# Altium schematic sheet 2 MCU.SchDoc: MCU
size A3; PageSetup: Record=PageOptions|CenterHorizontal=True|CenterVertical=True|PrintScale=1.01|XCorrection=1.00|YCorrection=1.00|PrintKind=2|BorderSize=5000000|LeftOffset=0|BottomOffset=0|Orientation=2|PaperLength=1000|PaperWidth=1000|Scale=100|PaperSource=15|PrintQuality=600|MediaType=1|DitherType=10|PaperKind=A3|PrintScaleMode=1; DocumentNumber: 4; SheetNumber: 3; SheetTotal: 7
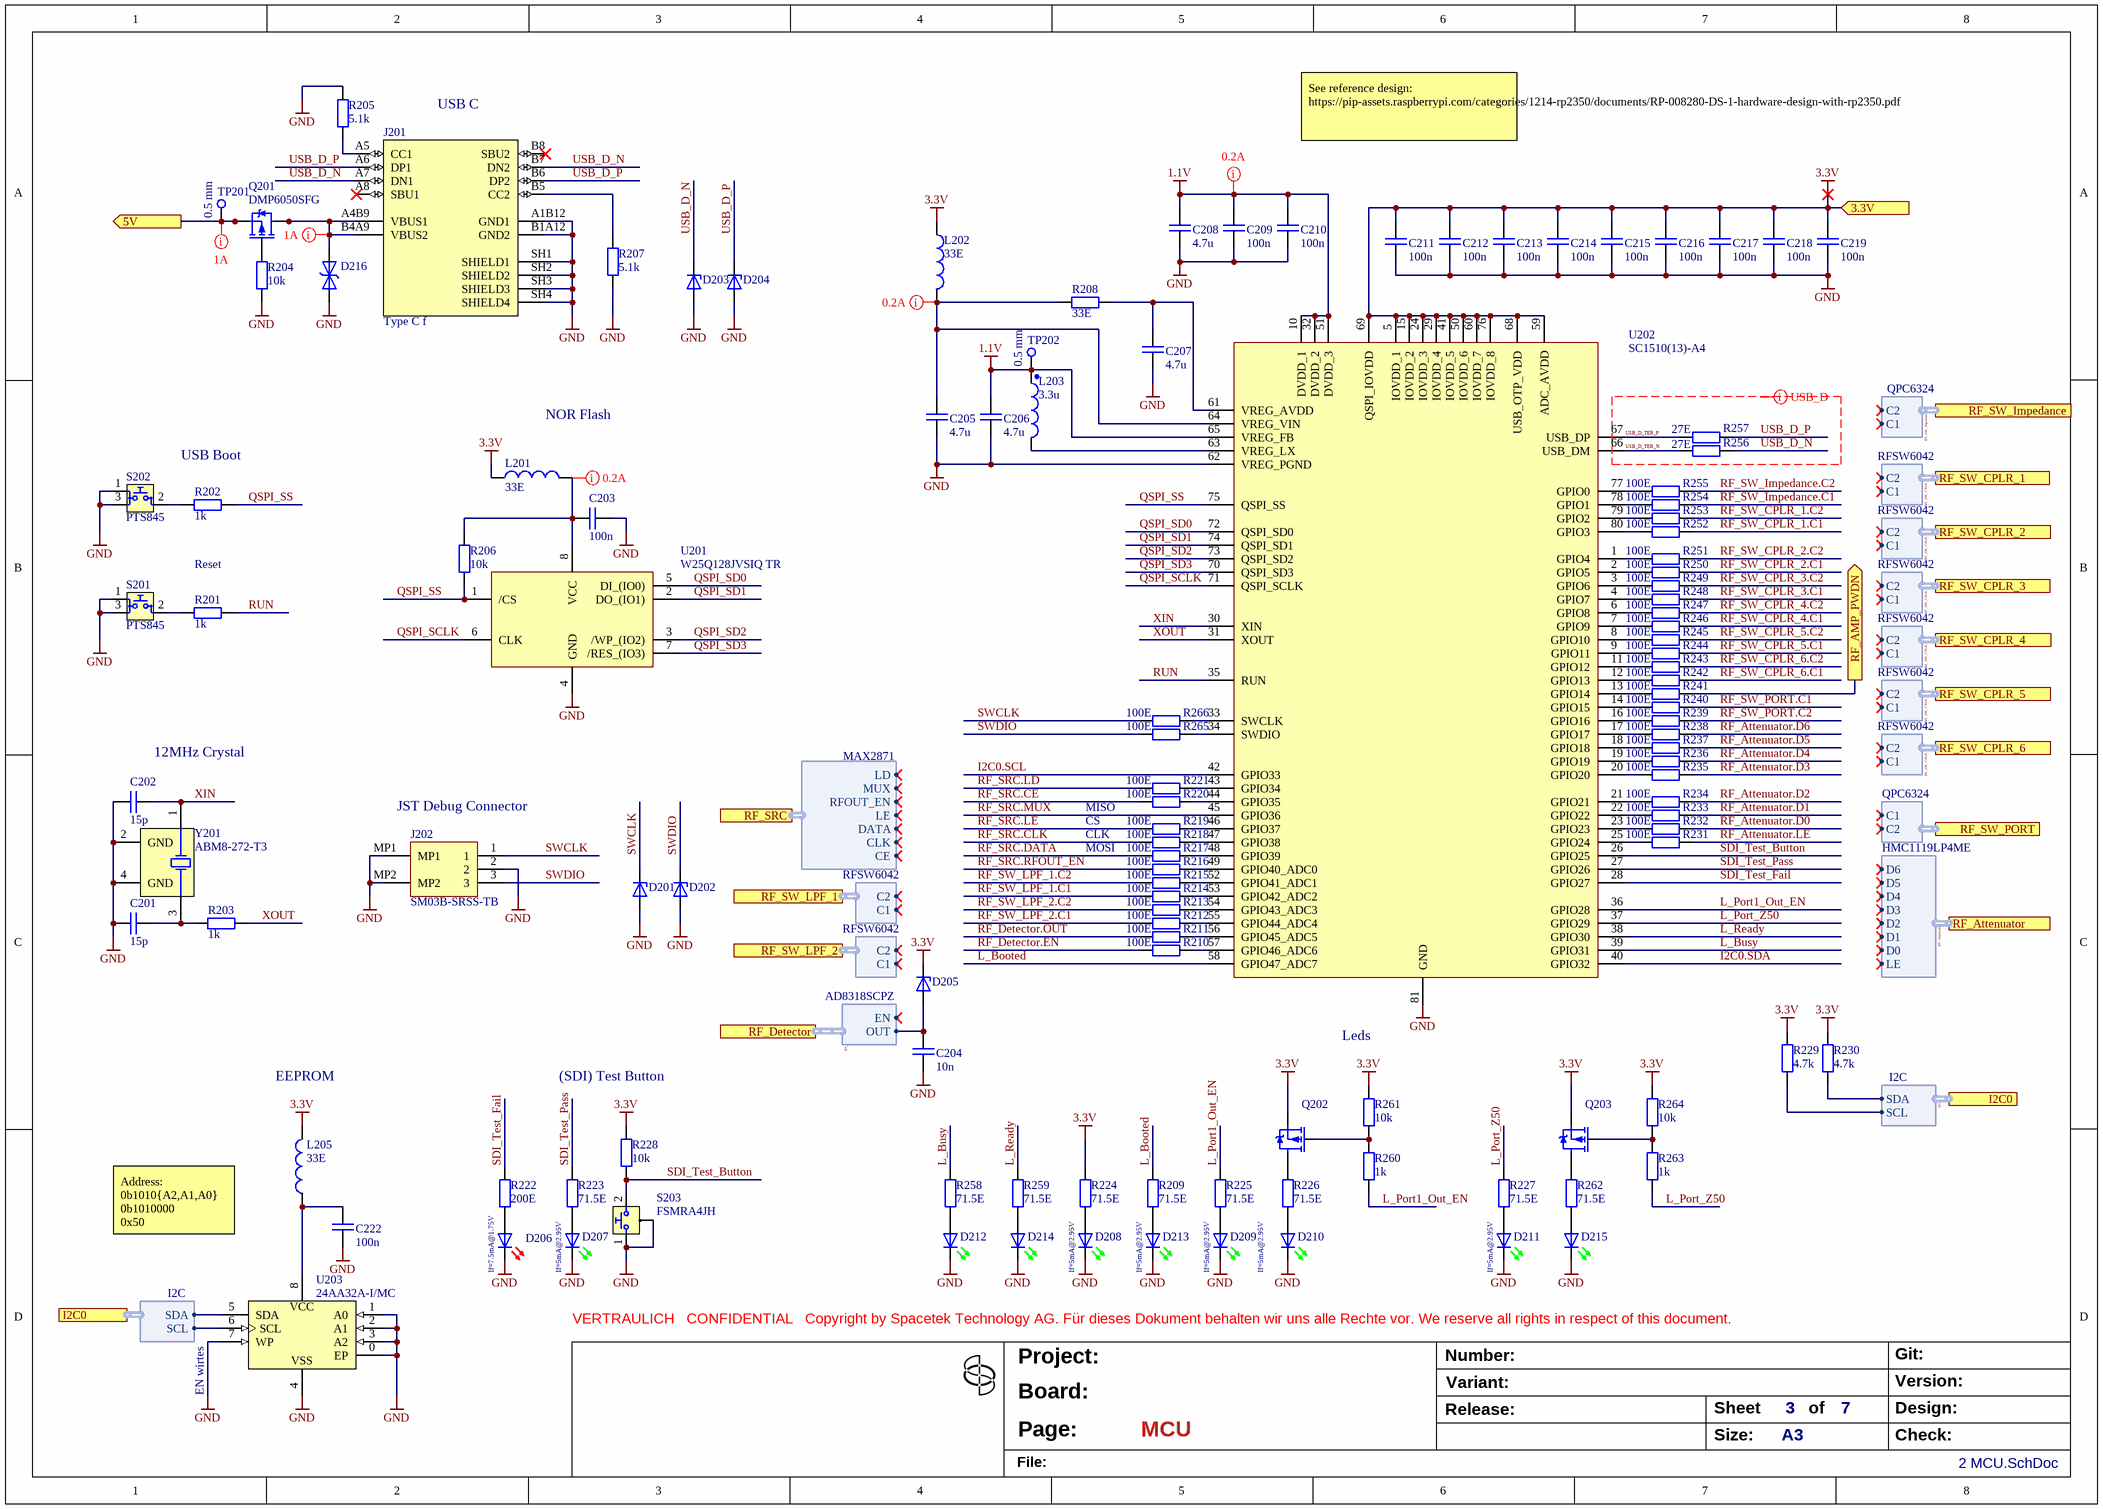
[diagram p0: 2 MCU.SchDoc]

## Parts
C201  15p  [STT--CC--0402]
C202  15p  [STT--CC--0402]
C203  100n  [STT--CC--0402]
C204  10n  [STT--CC--0402]
C205  4.7u  [STT--CC--0402]
C206  4.7u  [STT--CC--0402]
C207  4.7u  [STT--CC--0402]
C208  4.7u  [STT--CC--0402]
C209  100n  [STT--CC--0402]
C210  100n  [STT--CC--0402]
C211  100n  [STT--CC--0402]
C212  100n  [STT--CC--0402]
C213  100n  [STT--CC--0402]
C214  100n  [STT--CC--0402]
C215  100n  [STT--CC--0402]
C216  100n  [STT--CC--0402]
C217  100n  [STT--CC--0402]
C218  100n  [STT--CC--0402]
C219  100n  [STT--CC--0402]
C222  100n  [STT--CC--0402]
D201  ESD9R3.3S  [ONS--SD--SOD-923]  (value not drawn)
D202  ESD9R3.3S  [ONS--SD--SOD-923]  (value not drawn)
D203  ESD9R3.3S  [ONS--SD--SOD-923]  (value not drawn)
D204  ESD9R3.3S  [ONS--SD--SOD-923]  (value not drawn)
D205  ESD9R3.3S  [ONS--SD--SOD-923]  (value not drawn)
D206  150060RS75000  [STT--LD--0603-red]  (value not drawn)
D207  150060GS75000  [STT--LD--0603-green]  (value not drawn)
D208  150060GS75000  [STT--LD--0603-green]  (value not drawn)
D209  150060GS75000  [STT--LD--0603-green]  (value not drawn)
D210  150060GS75000  [STT--LD--0603-green]  (value not drawn)
D211  150060GS75000  [STT--LD--0603-green]  (value not drawn)
D212  150060GS75000  [STT--LD--0603-green]  (value not drawn)
D213  150060GS75000  [STT--LD--0603-green]  (value not drawn)
D214  150060GS75000  [STT--LD--0603-green]  (value not drawn)
D215  150060GS75000  [STT--LD--0603-green]  (value not drawn)
D216  SESD0402X1BN-0010-098  [LF--SD--0402R]  (value not drawn)
J201  Type C f  [MOL--CO--2171790001]
J202  SM03B-SRSS-TB  [JST--CO--SM03B-SRSS-TB]
L201  33E  [STT--FB--0402]
L202  33E  [STT--FB--0402]
L203  3.3u  [ABR--LF--0806]
L205  33E  [STT--FB--0402]
Q201  DMP6050SFG  [DIO--TR--POWERDI3333-8]
Q202  BSS84AK,215  [ONS--IC--SOT-23]  (value not drawn)
Q203  BSS84AK,215  [ONS--IC--SOT-23]  (value not drawn)
R201  1k  [STT--RC--0402]
R202  1k  [STT--RC--0402]
R203  1k  [STT--RC--0402]
R204  10k  [STT--RC--0402]
R205  5.1k  [STT--RC--0402]
R206  10k  [STT--RC--0402]
R207  5.1k  [STT--RC--0402]
R208  33E  [STT--RC--0402]
R209  71.5E  [STT--RC--0402]
R210  100E  [STT--RC--0402]
R211  100E  [STT--RC--0402]
R212  100E  [STT--RC--0402]
R213  100E  [STT--RC--0402]
R214  100E  [STT--RC--0402]
R215  100E  [STT--RC--0402]
R216  100E  [STT--RC--0402]
R217  100E  [STT--RC--0402]
R218  100E  [STT--RC--0402]
R219  100E  [STT--RC--0402]
R220  100E  [STT--RC--0402]
R221  100E  [STT--RC--0402]
R222  200E  [STT--RC--0402]
R223  71.5E  [STT--RC--0402]
R224  71.5E  [STT--RC--0402]
R225  71.5E  [STT--RC--0402]
R226  71.5E  [STT--RC--0402]
R227  71.5E  [STT--RC--0402]
R228  10k  [STT--RC--0402]
R229  4.7k  [STT--RC--0402]
R230  4.7k  [STT--RC--0402]
R231  100E  [STT--RC--0402]
R232  100E  [STT--RC--0402]
R233  100E  [STT--RC--0402]
R234  100E  [STT--RC--0402]
R235  100E  [STT--RC--0402]
R236  100E  [STT--RC--0402]
R237  100E  [STT--RC--0402]
R238  100E  [STT--RC--0402]
R239  100E  [STT--RC--0402]
R240  100E  [STT--RC--0402]
R241  100E  [STT--RC--0402]
R242  100E  [STT--RC--0402]
R243  100E  [STT--RC--0402]
R244  100E  [STT--RC--0402]
R245  100E  [STT--RC--0402]
R246  100E  [STT--RC--0402]
R247  100E  [STT--RC--0402]
R248  100E  [STT--RC--0402]
R249  100E  [STT--RC--0402]
R250  100E  [STT--RC--0402]
R251  100E  [STT--RC--0402]
R252  100E  [STT--RC--0402]
R253  100E  [STT--RC--0402]
R254  100E  [STT--RC--0402]
R255  100E  [STT--RC--0402]
R256  27E  [STT--RC--0402]
R257  27E  [STT--RC--0402]
R258  71.5E  [STT--RC--0402]
R259  71.5E  [STT--RC--0402]
R260  1k  [STT--RC--0402]
R261  10k  [STT--RC--0402]
R262  71.5E  [STT--RC--0402]
R263  1k  [STT--RC--0402]
R264  10k  [STT--RC--0402]
R265  100E  [STT--RC--0402]
R266  100E  [STT--RC--0402]
S201  PTS845  [CAK--PB--PTS485]
S202  PTS845  [CAK--PB--PTS485]
S203  FSMRA4JH  [TEC--PB--1-1825027-1]
TP201  0.5 mm  [STT--DO--TP-0.5]  (no BOM)
TP202  0.5 mm  [STT--DO--TP-0.5]  (no BOM)
U201  W25Q128JVSIQ TR  [WIB--IC--SOIC8]
U202  SC1510(13)-A4  [IC--RASPI--QFN-80]
U203  24AA32A-I/MC  [MIC--IC--QFN50P200X300X100_HS-9N-8]
Y201  ABM8-272-T3  [ABR--CR--ABM8]

## Ports
3.3V (in), 5V (out), I2C0 (harness I2C), RF_AMP_PWDN (out), RF_Attenuator (harness HMC1119LP4ME), RF_Detector (harness AD8318SCPZ), RF_SRC (harness MAX2871), RF_SW_CPLR_1 (harness RFSW6042), RF_SW_CPLR_2 (harness RFSW6042), RF_SW_CPLR_3 (harness RFSW6042), RF_SW_CPLR_4 (harness RFSW6042), RF_SW_CPLR_5 (harness RFSW6042), RF_SW_CPLR_6 (harness RFSW6042), RF_SW_Impedance (harness QPC6324), RF_SW_LPF_1 (harness RFSW6042), RF_SW_LPF_2 (harness RFSW6042), RF_SW_PORT (harness QPC6324)

## Harnesses
MAX2871: CLK, DATA, LE, RFOUT_EN, MUX, LD, CE
RFSW6042: C1, C2
HMC1119LP4ME: D6, D5, D2, D1, LE, D0, D4, D3
QPC6324: C1, C2
RFSW6042: C2, C1
AD8318SCPZ: OUT, EN
I2C: SCL, SDA

## Nets
1.1V: C206.2 C208.2 C209.2 C210.2 L203.1 TP202.1 U202.10(DVDD_1) U202.32(DVDD_2) U202.51(DVDD_3) U202.65(VREG_FB)
3.3V: C211.2 C212.2 C213.2 C214.2 C215.2 C216.2 C217.2 C218.2 C219.2 D205.2(K) L201.1 L202.1 L205.2 Q202.3(S) Q203.3(S) R224.2 R228.2 R229.2 R230.2 R261.2 R264.2 U202.5(IOVDD_1) U202.15(IOVDD_2) U202.24(IOVDD_3) U202.29(IOVDD_4) U202.41(IOVDD_5) U202.50(IOVDD_6) U202.59(ADC_AVDD) U202.60(IOVDD_7) U202.68(USB_OTP_VDD) U202.69(QSPI_IOVDD) U202.76(IOVDD_8) ; port 3.3V
GND: C201.1 C202.1 C203.1 C204.1 C205.1 C206.1 C207.1 C208.1 C209.1 C210.1 C211.1 C212.1 C213.1 C214.1 C215.1 C216.1 C217.1 C218.1 C219.1 C222.2 D201.1(A) D202.1(A) D203.1(A) D204.1(A) D206.2(K) D207.2(K) D208.2(K) D209.2(K) D210.2(K) D211.2(K) D212.2(K) D213.2(K) D214.2(K) D215.2(K) D216.1 J201.A1B12(GND1) J201.B1A12(GND2) J201.SH1(SHIELD1) J201.SH2(SHIELD2) J201.SH3(SHIELD3) J201.SH4(SHIELD4) J202.2 J202.MP1 J202.MP2 R204.1 R205.1 R207.1 S201.1 S201.3 S202.1 S202.3 S203.0 S203.1 U201.4(GND) U202.62(VREG_PGND) U202.81(GND) U203.0(EP) U203.1(A0) U203.2(A1) U203.3(A2) U203.4(VSS) U203.7(WP) Y201.2(GND) Y201.4(GND)
5V: Q201.1(S) Q201.2(S) Q201.3(S) TP201.1 ; port 5V
I2C0.SCL: U202.42(GPIO33)
I2C0.SCL: R229.1 U203.6(SCL) ; port I2C0.SCL  [a separate net that carries the same name]
I2C0.SDA: U202.40(GPIO32)
I2C0.SDA: R230.1 U203.5(SDA) ; port I2C0.SDA  [a separate net that carries the same name]
L_Booted: R209.2 U202.58(GPIO47_ADC7)
L_Busy: R258.2 U202.39(GPIO31)
L_Port1_Out_EN: R225.2 R260.1 U202.36(GPIO28)
L_Port_Z50: R227.2 R263.1 U202.37(GPIO29)
L_Ready: R259.2 U202.38(GPIO30)
QSPI_SCLK: U201.6(CLK) U202.71(QSPI_SCLK)
QSPI_SD0: U201.5(DI_(IO0)) U202.72(QSPI_SD0)
QSPI_SD1: U201.2(DO_(IO1)) U202.74(QSPI_SD1)
QSPI_SD2: U201.3(/WP_(IO2)) U202.73(QSPI_SD2)
QSPI_SD3: U201.7(/RES_(IO3)) U202.70(QSPI_SD3)
QSPI_SS: R202.1 R206.1 U201.1(/CS) U202.75(QSPI_SS)
RF_AMP_PWDN: R241.2 ; port RF_AMP_PWDN
RF_Attenuator.D0: R232.2
RF_Attenuator.D1: R233.2
RF_Attenuator.D2: R234.2
RF_Attenuator.D3: R235.2
RF_Attenuator.D4: R236.2
RF_Attenuator.D5: R237.2
RF_Attenuator.D6: R238.2
RF_Attenuator.LE: R231.2
RF_Detector.EN: R210.1
RF_Detector.OUT: R211.1
RF_Detector.OUT: C204.2 D205.1(A) ; port RF_Detector.OUT  [a separate net that carries the same name]
RF_SRC.CE: R220.1
RF_SRC.CLK: R218.1
RF_SRC.DATA: R217.1
RF_SRC.LD: R221.1
RF_SRC.LE: R219.1
RF_SRC.MUX: U202.45(GPIO36)
RF_SRC.RFOUT_EN: R216.1
RF_SW_CPLR_1.C1: R252.2
RF_SW_CPLR_1.C2: R253.2
RF_SW_CPLR_2.C1: R250.2
RF_SW_CPLR_2.C2: R251.2
RF_SW_CPLR_3.C1: R248.2
RF_SW_CPLR_3.C2: R249.2
RF_SW_CPLR_4.C1: R246.2
RF_SW_CPLR_4.C2: R247.2
RF_SW_CPLR_5.C1: R244.2
RF_SW_CPLR_5.C2: R245.2
RF_SW_CPLR_6.C1: R242.2
RF_SW_CPLR_6.C2: R243.2
RF_SW_Impedance.C1: R254.2
RF_SW_Impedance.C2: R255.2
RF_SW_LPF_1.C1: R214.1
RF_SW_LPF_1.C2: R215.1
RF_SW_LPF_2.C1: R212.1
RF_SW_LPF_2.C2: R213.1
RF_SW_PORT.C1: R240.2
RF_SW_PORT.C2: R239.2
RUN: R201.1 U202.35(RUN)
SDI_Test_Button: R228.1 S203.2 U202.26(GPIO25)
SDI_Test_Fail: R222.2 U202.28(GPIO27)
SDI_Test_Pass: R223.2 U202.27(GPIO26)
SWCLK: D201.2(K) J202.1 R266.1
SWDIO: D202.2(K) J202.3 R265.1
USB_D_N: D203.2(K) J201.A7(DN1) J201.B7(DN2) R256.2
USB_D_P: D204.2(K) J201.A6(DP1) J201.B6(DP2) R257.2
USB_D_TER_N: R256.1 U202.66(USB_DM)
USB_D_TER_P: R257.1 U202.67(USB_DP)
XIN: C202.2 U202.30(XIN) Y201.1(X1)
XOUT: R203.1 U202.31(XOUT)
NetC201_2: C201.2 R203.2 Y201.3(X2)
NetC203_2: C203.2 L201.2 R206.2 U201.8(VCC)
NetC205_2: C205.2 L202.2 R208.1 U202.64(VREG_VIN)
NetC207_2: C207.2 R208.2 U202.61(VREG_AVDD)
NetC222_1: C222.1 L205.1 U203.8(VCC)
NetD206_1: D206.1(A) R222.1
NetD207_1: D207.1(A) R223.1
NetD208_1: D208.1(A) R224.1
NetD209_1: D209.1(A) R225.1
NetD210_1: D210.1(A) R226.1
NetD211_1: D211.1(A) R227.1
NetD212_1: D212.1(A) R258.1
NetD213_1: D213.1(A) R209.1
NetD214_1: D214.1(A) R259.1
NetD215_1: D215.1(A) R262.1
NetD216_2: D216.2 J201.A4B9(VBUS1) J201.B4A9(VBUS2) Q201.5(D) Q201.6(D) Q201.7(D) Q201.8(D)
NetJ201_A5: J201.A5(CC1) R205.2
NetJ201_B5: J201.B5(CC2) R207.2
NetL203_2: L203.2 U202.63(VREG_LX)
NetQ201_4: Q201.4(G) R204.2
NetQ202_1: Q202.1(G) R260.2 R261.1
NetQ202_2: Q202.2(D) R226.2
NetQ203_1: Q203.1(G) R263.2 R264.1
NetQ203_2: Q203.2(D) R262.2
NetR201_2: R201.2 S201.2
NetR202_2: R202.2 S202.2
NetR210_2: R210.2 U202.57(GPIO46_ADC6)
NetR211_2: R211.2 U202.56(GPIO45_ADC5)
NetR212_2: R212.2 U202.55(GPIO44_ADC4)
NetR213_2: R213.2 U202.54(GPIO43_ADC3)
NetR214_2: R214.2 U202.53(GPIO42_ADC2)
NetR215_2: R215.2 U202.52(GPIO41_ADC1)
NetR216_2: R216.2 U202.49(GPIO40_ADC0)
NetR217_2: R217.2 U202.48(GPIO39)
NetR218_2: R218.2 U202.47(GPIO38)
NetR219_2: R219.2 U202.46(GPIO37)
NetR220_2: R220.2 U202.44(GPIO35)
NetR221_2: R221.2 U202.43(GPIO34)
NetR231_1: R231.1 U202.25(GPIO24)
NetR232_1: R232.1 U202.23(GPIO23)
NetR233_1: R233.1 U202.22(GPIO22)
NetR234_1: R234.1 U202.21(GPIO21)
NetR235_1: R235.1 U202.20(GPIO20)
NetR236_1: R236.1 U202.19(GPIO19)
NetR237_1: R237.1 U202.18(GPIO18)
NetR238_1: R238.1 U202.17(GPIO17)
NetR239_1: R239.1 U202.16(GPIO16)
NetR240_1: R240.1 U202.14(GPIO15)
NetR241_1: R241.1 U202.13(GPIO14)
NetR242_1: R242.1 U202.12(GPIO13)
NetR243_1: R243.1 U202.11(GPIO12)
NetR244_1: R244.1 U202.9(GPIO11)
NetR245_1: R245.1 U202.8(GPIO10)
NetR246_1: R246.1 U202.7(GPIO9)
NetR247_1: R247.1 U202.6(GPIO8)
NetR248_1: R248.1 U202.4(GPIO7)
NetR249_1: R249.1 U202.3(GPIO6)
NetR250_1: R250.1 U202.2(GPIO5)
NetR251_1: R251.1 U202.1(GPIO4)
NetR252_1: R252.1 U202.80(GPIO3)
NetR253_1: R253.1 U202.79(GPIO2)
NetR254_1: R254.1 U202.78(GPIO1)
NetR255_1: R255.1 U202.77(GPIO0)
NetR265_2: R265.2 U202.34(SWDIO)
NetR266_2: R266.2 U202.33(SWCLK)

Not connected (* = marked no-connect by the designer): J201 A8(SBU1)* B8(SBU2)*

## Buses and harness runs
harness I2C0 = port I2C0
harness RF_Attenuator = port RF_Attenuator
harness RF_Detector = port RF_Detector
harness RF_SRC = port RF_SRC
harness RF_SW_CPLR_1 = port RF_SW_CPLR_1
harness RF_SW_CPLR_2 = port RF_SW_CPLR_2
harness RF_SW_CPLR_3 = port RF_SW_CPLR_3
harness RF_SW_CPLR_4 = port RF_SW_CPLR_4
harness RF_SW_CPLR_5 = port RF_SW_CPLR_5
harness RF_SW_CPLR_6 = port RF_SW_CPLR_6
harness RF_SW_Impedance = port RF_SW_Impedance
harness RF_SW_LPF_1 = port RF_SW_LPF_1
harness RF_SW_LPF_2 = port RF_SW_LPF_2
harness RF_SW_PORT = port RF_SW_PORT

## Layout directives
net class 1A: 5V, NetD216_2
net class 0.2A: 1.1V, NetC203_2, NetC205_2
differential pair; rule Differential Pairs Routing [Pref Gap = 6mil    Min Gap  = 6mil    Max Gap  = 6milPref Width = 8.96mil    Min Width  = 8.96mil    Max Width  = 8.96mil]; rule Clearance Constraint [Clearance = 7mil]; differential pair class USB_D; net class USB_D: USB_D_N, USB_D_P, USB_D_TER_N, USB_D_TER_P

## Notes on the sheet
- (near J201) USB C
- See reference design: https://pip-assets.raspberrypi.com/categories/1214-rp2350/documents/RP-008280-DS-1-hardware-design-with-rp2350.pdf
- NOR Flash
- USB Boot
- Reset
- 12MHz Crystal
- (near J202) JST Debug Connector
- MISO
- CS
- CLK
- MOSI
- Leds
- EEPROM
- (SDI) Test Button
- Address:
  0b1010{A2,A1,A0}
  0b1010000
  0x50
- (near D206) If=7.5mA@1.75V
- (near D207) If=5mA@2.95V
- (near D208) If=5mA@2.95V
- (near D213) If=5mA@2.95V
- (near D209) If=5mA@2.95V
- If=5mA@2.95V
- (near D211) If=5mA@2.95V
- (near U203) EN wirtes
- VERTRAULICH   CONFIDENTIAL   Copyright by Spacetek Technology AG. Für dieses Dokument behalten wir uns alle Rechte vor. We reserve all rights in respect of this document.
- Project:
- Number:
- Variant:
- Version:
- Git:
- Board:
- Page:
- Release:
- Size:
- Sheet
- A3
- of
- Design:
- Check:
- File:

## Library data of the parts
C201 C202 = CMP-010-000103-1: Capacitor ceramic 15p 50V 1% C0G  SMD--0402; Partnumber: CQ0402FRNPO9BN150; Manufacturer: Yageo; Voltage: 50V; Type: Capacitor ceramic; Material: C0G; Status: released; Tolerance: 1%; Value: 15p; Package: SMD--0402
C203 C209-C219 C222 = 200032-3: Capacitor ceramic 100n 16V 10% X7R  SMD--0402; Partnumber: CL05B104KO5NNNC; Manufacturer: Samsung Electro-Mechanics; A-Number: 200032; Material: X7R; Voltage: 16V; Type: Capacitor ceramic; Tolerance: 10%; Status: released; Package: SMD--0402; Value: 100n
C204 = CMP-010-000007-3: Capacitor ceramic 10n 35V 2% C0G SMD--0402; Manufacturer: Murata Electronics; Partnumber: GRM1555CYA103GE01; A-Number: 200032; Voltage: 35V; Status: released; Tolerance: 2%; Type: Capacitor ceramic; Package: SMD--0402; Material: C0G; Value: 10n
C205-C208 = 200037-1: Capacitor ceramic 4.7u 6.3V 20% X5R  SMD--0402; Partnumber: GRM155R60J475ME47D; Manufacturer: Murata Electronics; A-Number: 200037; Package: SMD--0402; Type: Capacitor ceramic; Voltage: 6.3V; Value: 4.7u; Material: X5R; Tolerance: 20%; Status: released
D201-D205 = 400052-1: TVS Diode ESD9R3.3ST5G 3V3  0.5pF, 1nA SMD--SOD-923; Manufacturer: ON Semiconductors; Power: 150mW; preferred: yes; A-Number: 400052; Partnumber: ESD9R3.3ST5G; Package: SMD--SOD-923; Special: 0.5pF, 1nA; Type: TVS Diode; Status: active; Voltage: 3V3; Value: ESD9R3.3S
D206 = 400015-1: LED 150060RS75000 2V 30mA Red 630nm 250mcd 140° SMD--0603; Manufacturer: Wuert Elektronik; preferred: yes; A-Number: 400015; Current: 30mA; Package: SMD--0603; Value: 150060RS75000; Type: LED; Status: active; Special: Red 630nm 250mcd 140°; Voltage: 2V; Partnumber: 150060RS75000
D207-D215 = 400014-1: LED 150060GS75000 3.2V 30mA Green 515nm 430 mcd 140° SMD--0603; Manufacturer: Wuert Elektronik; A-Number: 400014; Special: Green 515nm 430 mcd 140°; Voltage: 3.2V; Type: LED; Value: 150060GS75000; Partnumber: 150060GS75000; Status: released; Package: SMD--0603; Current: 30mA
D216 = CMP-039-000055-1: TVS Diode, 7V, 0.1pF; Manufacturer: Littelfuse; Meta Data Version: v1.0; Component Category: Generic; Type: TVS Diode; Partnumber: SESD0402X1BN-0010-098; Status: released; Value: SESD0402X1BN-0010-098
J201 = CMP-205-000000-4: Connector USB 2171790001 Type C f MOL--CO--2171790001; Manufacturer: Molex; Special: USB 2.0; Value: Type C f; Type: Connector USB; Partnumber: 2171790001; Status: draft
J202 = CMP-023-000161-3: Connector SM03B-SRSS-TB SMD, 90°, Raspberry JST Debug; Component Category: generic; Meta Data Version: v1.0; Type: Connector; Manufacturer: JST; Partnumber: SM03B-SRSS-TB; Value: SM03B-SRSS-TB; Status: released
L201 L202 L205 = 300015-1: Ferrit Bead MPZ1005S330HT000 33E 3A 22mE SMD--0402; Manufacturer: TDK Group; preferred: Yes; A-Number: 300015; Status: active; Current: 3A; Type: Ferrit Bead; Value: 33E; Package: MPZ1005S330HT000; Special: 22mE; Partnumber: MPZ1005S330HT000
L203 = CMP-012-000029-1: Inductor AOTA-B201610S3R3-101-T 3.3u 2.1A 140mOhm; Manufacturer: ABRACON; Component Category: generic; Meta Data Version: v1.0; Type: Inductor; Value: 3.3u; Partnumber: AOTA-B201610S3R3-101-T; Status: released
Q201 = CMP-054-000007-3: MOSFET, P-channel, 60 V, -4.8 A; Manufacturer: Diodes; Partnumber: DMP6050SFG-13; Type: Transistor, MOSFET, P; Value: DMP6050SFG; Status: released
Q202 Q203 = CMP-054-000009-3: MOSFET P-CH 50V 180MA TO236AB; Manufacturer: Nexperia USA Inc.; Status: released; E-Nummer: -; Partnumber: BSS84AK,215; Value: BSS84AK
R201-R203 R260 R263 = 100077-2: Resistor 1k 50V  0.063W 1%  SMD--0402; Partnumber: ERJ-2RKF1001X; Manufacturer: Panasonic; A-Number: 100077; Power: 0.063W; Value: 1k; Status: released; Package: SMD--0402; Type: Resistor; Tolerance: 1%; Voltage: 50V
R204 R206 R228 R261 R264 = 100086-1: Resistor 10k 50V  0.063W 1%  SMD--0402; Partnumber: ERJ-2RKF1002X; Manufacturer: Panasonic; A-Number: 100086; Power: 0.063W; Status: released; Type: Resistor; Voltage: 50V; Tolerance: 1%; Value: 10k; Package: SMD--0402
R205 R207 = CMP-009-000042-2: Resistor 5.1k 50V  0.063W 1%  SMD--0402; Partnumber: ERJ-2RKF5101X; Manufacturer: Panasonic; Value: 5.1k; Tolerance: 1%; Package: SMD--0402; Power: 0.063W; Status: released; Voltage: 50V; Type: Resistor
R208 = 100061-1: Resistor 33E 50V  0.063W 0.5%  SMD--0402; Partnumber: ERA-2AKD330X; Manufacturer: Panasonic; A-Number: 100061; Value: 33E; Voltage: 50V; Power: 0.063W; Package: SMD--0402; Type: Resistor; Status: released; Tolerance: 0.5%
R209 R223-R227 R258 R259 R262 = CMP-009-000263-1: Resistor 71.5E 50V 0.0625W 0.1% SMD--0402; Manufacturer: Panasonic; Partnumber: ERA-2AEB71R5X; Component Category: Generic; Meta Data Version: v1.0; Value: 71.5E; Status: released
R210-R221 R231-R255 R265 R266 = 100068-1: Resistor 100E 50V  0.063W 0.01  SMD--0402; Partnumber: CRCW0402100RFKEDC; Manufacturer: Vishay; A-Number: 100068; Tolerance: 0.01; Power: 0.063W; Package: SMD--0402; Value: 100E; Status: released; Type: Resistor; Voltage: 50V
R222 = 100075-2: Resistor 200E 50V  0.063W 1%  SMD--0402; Partnumber: ERJ-2RKF2000X; Manufacturer: Panasonic; A-Number: 100075; Status: released; Voltage: 50V; Package: SMD--0402; Value: 200E; Power: 0.063W; Type: Resistor; Tolerance: 1%
R229 R230 = 100078-1: Resistor 4.7k 50V  0.063W 1%  SMD--0402; Partnumber: ERJ-2RKF4701X; Manufacturer: Panasonic; A-Number: 100078; Voltage: 50V; Tolerance: 1%; Value: 4.7k; Power: 0.063W; Type: Resistor; Status: released; Package: SMD--0402
R256 R257 = 100092-3: Resistor 27E 50V  0.063W 1%  SMD--0402; Partnumber: CRCW040227R0FKED; Manufacturer: Vishay; Component Category: Generic; Meta Data Version: V1.0; Value: 27E; Status: released
S201 S202 = CMP-033-000000-2: Pushbutton PTS845 90° SMD; Manufacturer: C&K; Partnumber: PTS845VM20PSMTR4-LFS; Type: Pushbutton; Value: PTS845; Special: 90°; Package: SMD
S203 = 700081-1: Pushbutton 1-1825027-1 24V 50mA 90° THT-4pin; Manufacturer: TE Connectivity; A-Number: 700081; preferred: yes; Partnumber: 1-1825027-1; Type: Pushbutton; Value: FSMRA4JH; Special: 90°; Package: THT-4pin; Status: active; Current: 50mA
TP201 TP202 = CMP-043-000000-4: Pad TP SMD--Pad 0.5; Special: 0.5; preferred: Yes; Status: active; Partnumber: TP; Value: 0.5 mm; Package: SMD--Pad; Type: Pad
U201 = CMP-117-000001-2: NOR-Flash Memory W25Q128JVSIQ TR SPI SMD--SOIC8; Manufacturer: Winbond; Meta Data Version: v1.0; Voltage: 3.3V; Component Category: generic; Status: released; Type: Flash; Value: W25Q128JVSIQ TR; Special: SPI; Partnumber: W25Q128JVSIQ TR
U202 = CMP-023-000160-3: MCU RP2350B 150MHz clock Dual Arm Cortex-M33 cores 520KB RAM 8KB on-chip QFN-80; Manufacturer: Raspberry Pi Foundation; Component Category: generic; Meta Data Version: v1.0; Type: MCU; Value: SC1510(13)-A4; Partnumber: SC1510(13)-A4; Status: released
U203 = CMP-117-000000-2: EEPROM 24AA32AT 32K SMD--DFN; Manufacturer: Microchip Technology; Partnumber: 24AA32AT-I/MC; Voltage: 1.7-5.5V; A-Number: 500053; preferred: yes; Package: SMD--DFN; Type: EEPROM; Status: active; Special: 32K; Value: 24AA32A
Y201 = CMP-038-000006-1: Crystal ABM8-272-T3 12.0000MHZ 10PF SMD--ABSL2; Manufacturer: Abracon LLC; Tolerance: 30ppm; Status: released; Type: Crystal; Partnumber: ABM8-272-T3; Value: ABM8-272-T3